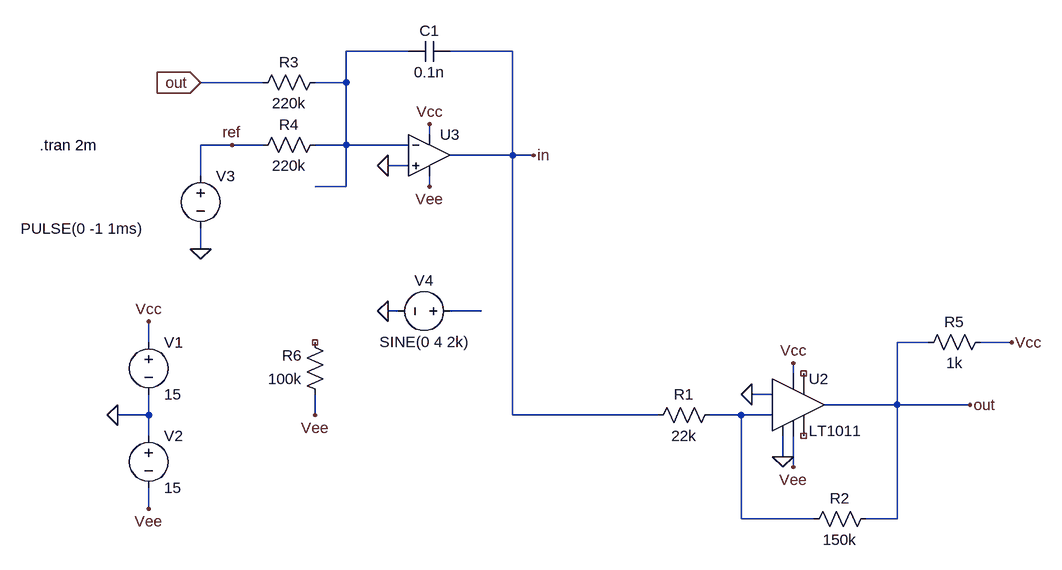
[diagram p0: schematic VCO P2.asc]
VCO P2.asc, the LTspice schematic file:
Version 4
SHEET 1 1360 680
WIRE 368 -304 272 -304
WIRE 528 -304 432 -304
WIRE 144 -256 48 -256
WIRE 272 -256 272 -304
WIRE 272 -256 224 -256
WIRE 400 -176 400 -192
WIRE 96 -160 48 -160
WIRE 144 -160 96 -160
WIRE 272 -160 272 -256
WIRE 272 -160 224 -160
WIRE 368 -160 272 -160
WIRE 528 -144 528 -304
WIRE 528 -144 432 -144
WIRE 560 -144 528 -144
WIRE 368 -128 336 -128
WIRE 48 -112 48 -160
WIRE 272 -96 272 -160
WIRE 272 -96 224 -96
WIRE 400 -96 400 -112
WIRE 48 0 48 -32
WIRE 352 96 336 96
WIRE 480 96 432 96
WIRE -32 144 -32 112
WIRE 1168 144 1120 144
WIRE 1296 144 1248 144
WIRE 960 192 960 176
WIRE 928 224 896 224
WIRE 1120 240 1120 144
WIRE 1120 240 1008 240
WIRE 1232 240 1120 240
WIRE -32 256 -32 224
WIRE -32 256 -80 256
WIRE 224 256 224 224
WIRE 528 256 528 -144
WIRE 752 256 528 256
WIRE 880 256 832 256
WIRE 928 256 880 256
WIRE -32 288 -32 256
WIRE 944 320 944 288
WIRE 960 336 960 288
WIRE -32 400 -32 368
WIRE 880 416 880 256
WIRE 992 416 880 416
WIRE 1120 416 1120 240
WIRE 1120 416 1072 416
FLAG -80 256 0
FLAG -32 112 Vcc
FLAG -32 400 Vee
FLAG 48 0 0
FLAG 336 -128 0
FLAG 944 320 0
FLAG 896 224 0
FLAG 400 -192 Vcc
FLAG 960 176 Vcc
FLAG 1296 144 Vcc
FLAG 224 256 Vee
FLAG 400 -96 Vee
FLAG 960 336 Vee
FLAG 1232 240 out
FLAG 96 -160 ref
FLAG 560 -144 in
FLAG 336 96 0
FLAG 48 -256 out
IOPIN 48 -256 In
SYMBOL voltage -32 128 R0
SYMATTR InstName V1
SYMATTR Value 15
SYMBOL voltage -32 272 R0
SYMATTR InstName V2
SYMATTR Value 15
SYMBOL voltage 48 -128 R0
WINDOW 3 -277 97 Left 2
WINDOW 123 0 0 Left 2
WINDOW 39 0 0 Left 2
SYMATTR InstName V3
SYMATTR Value PULSE(0 -1 1ms)
SYMBOL res 240 -176 R90
WINDOW 0 0 56 VBottom 2
WINDOW 3 32 56 VTop 2
SYMATTR InstName R4
SYMATTR Value 220k
SYMBOL res 240 240 R180
WINDOW 0 36 76 Left 2
WINDOW 3 36 40 Left 2
SYMATTR InstName R6
SYMATTR Value 100k
SYMBOL cap 432 -320 R90
WINDOW 0 0 32 VBottom 2
WINDOW 3 32 32 VTop 2
SYMATTR InstName C1
SYMATTR Value 0.1n
SYMBOL res 848 240 R90
WINDOW 0 0 56 VBottom 2
WINDOW 3 32 56 VTop 2
SYMATTR InstName R1
SYMATTR Value 22k
SYMBOL Comparators/LT1011 960 240 R0
SYMATTR InstName U2
SYMBOL res 1088 400 R90
WINDOW 0 0 56 VBottom 2
WINDOW 3 32 56 VTop 2
SYMATTR InstName R2
SYMATTR Value 150k
SYMBOL res 1264 128 R90
WINDOW 0 0 56 VBottom 2
WINDOW 3 32 56 VTop 2
SYMATTR InstName R5
SYMATTR Value 1k
SYMBOL Opamps/UniversalOpamp2 400 -144 R0
SYMATTR InstName U3
SYMBOL voltage 448 96 R90
WINDOW 0 -32 56 VBottom 2
WINDOW 3 32 56 VTop 2
SYMATTR InstName V4
SYMATTR Value SINE(0 4 2k)
SYMBOL res 240 -272 R90
WINDOW 0 0 56 VBottom 2
WINDOW 3 32 56 VTop 2
SYMATTR InstName R3
SYMATTR Value 220k
TEXT -200 -160 Left 2 !.tran 2m

The netlist it stands for:
* VCO P2.asc
V1 Vcc 0 15
V2 0 Vee 15
V3 ref 0 PULSE(0 -1 1ms)
R4 N001 ref 220k
R6 Vee NC_01 100k
C1 in N001 0.1n
R1 N003 in 22k
XU2 0 N003 0 Vee NC_02 NC_03 out Vcc LT1011
R2 out N003 150k
R5 Vcc out 1k
XU3 0 N001 Vcc Vee in level.2 Avol=1Meg GBW=10Meg Slew=10Meg ilimit=25m rail=0 Vos=0 phimargin=45 en=0 enk=0 in=0 ink=0 Rin=500Meg  ; pins IN+ IN- V+ V- OUT
V4 N002 0 SINE(0 4 2k)
R3 N001 out 220k
.tran 2m
.lib LTC1.lib
.lib UniversalOpamps2.sub
.backanno
.end